# Altium project Modulo Banco MK1.PrjPcb (part 1 of 2)
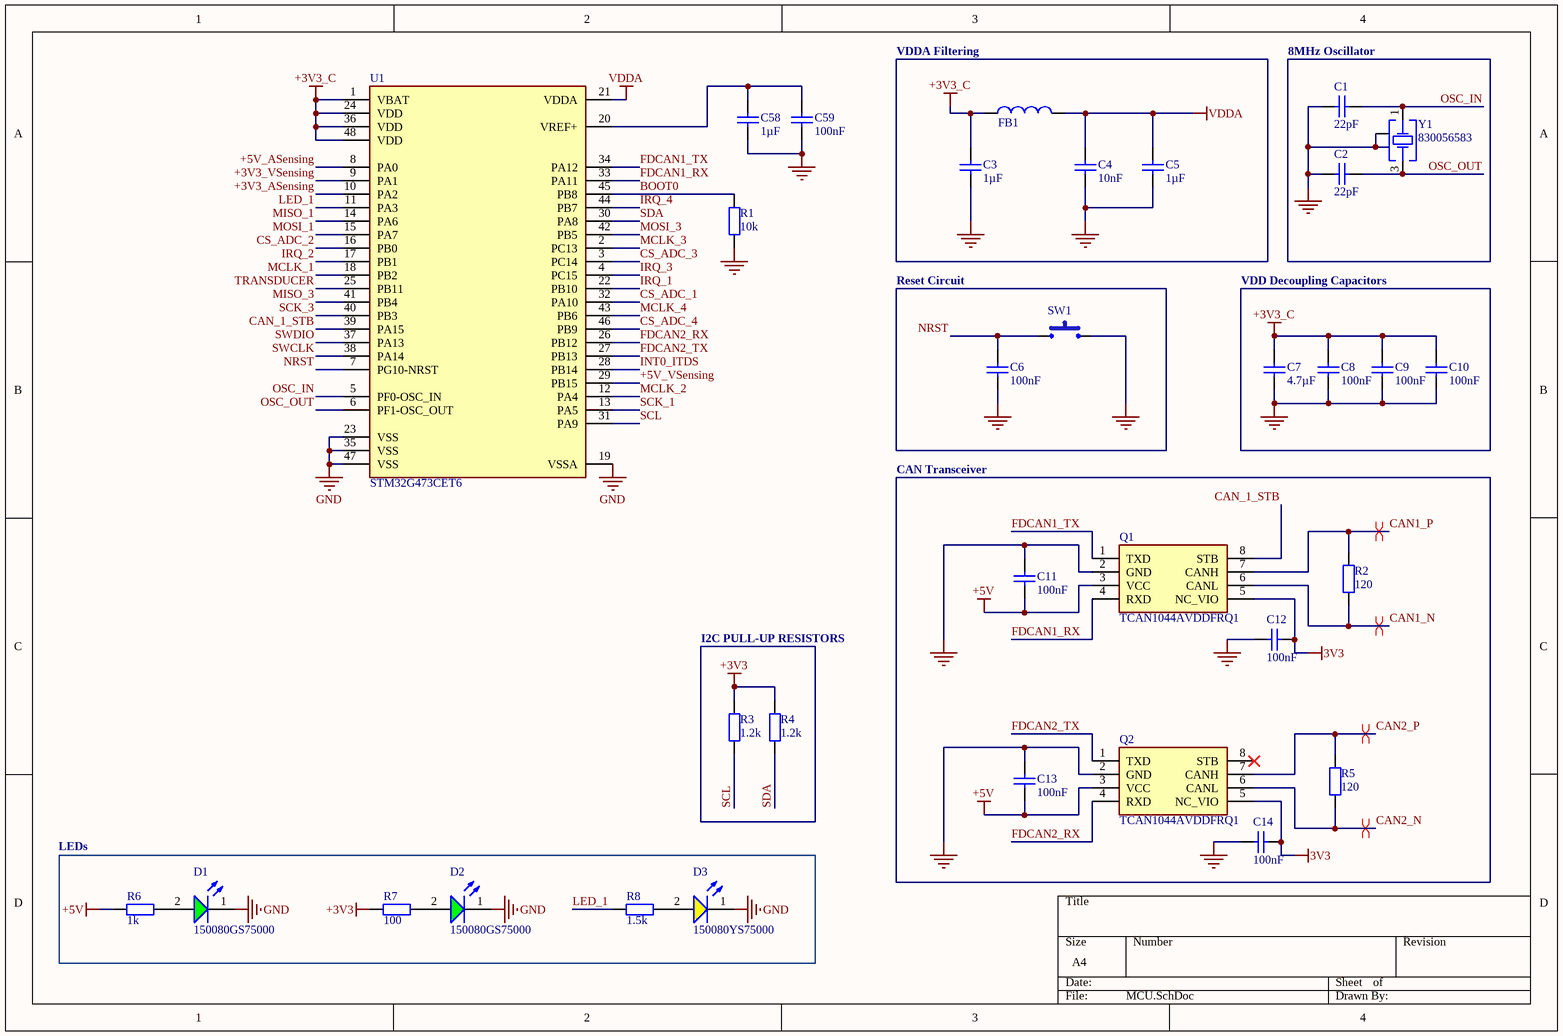
[diagram p0: MCU.SchDoc]
6 sheets, 168 parts. Net scope: global (net labels, ports and power ports of the same name join across sheets).
Board file: PCB_Banco.PcbDoc
Sheets:
  MCU.SchDoc
  Connectors_ADC.SchDoc
  Connectors_General.SchDoc
  Sensors.SchDoc
  ADCs.SchDoc
  Sensing current.SchDoc

## Sheet MCU.SchDoc
size A4; SheetNumber: 1; SheetTotal: 6; SPICEModelCacheQSCFDVKM: <root> / <DocumentId>QSCFDVKM</DocumentId> / <CacheFrame Number="0"> / <Model Name="0805_150080gs75000" Kind="CKT"> / <Text>****** / .subckt 0805_150080GS75000  1  2 / D1 1 2 SMCW / .MODEL SMCW D / + IS=906.98E-12 / + N=4.4982 / + RS=1.5743 / + IKF=518.93E-9 / + CJO=1.0000E-12 / + M=.3333 / + VJ=.75 / + BV=5 / + IBV=10.00E-6 / + TT=5.0000E-9 / .ends</Text> / </Model> / <Model Name="0603_885012206071_100nf" Kind="CKT"> / <Text>******* / .subckt 0603_885012206071_100nF 1 2 / Rser 1 3 0.025 / Lser 2 4 0.0000000008 / C1 3 4 0.0000001 / Rpar 3 4 5000000000 / .ends 0603_885012206071_100nF</Text> / </Model> / <Model Name="0805_150080ys75000" Kind="CKT"> / <Text>****** / .subckt 0805_150080YS75000  1  2 / D1 1 2 SMCW / .MODEL SMCW D / + IS=10.000E-21 / + N=1.8000 / + RS=1.0003E-6 / + IKF=1.8092E-3 / + CJO=1.0000E-12 / + M=.3333 / + VJ=.75 / + BV=5 / + IBV=10.00E-6 / + TT=5.0000E-9 / .ends</Text> / </Model> / </CacheFrame> / </root>

### Parts
C1  value 22pF  [WCAP-CSGP_0603_L1.6W0.8H0.8_Reflow]  (hidden comment: 885012006034)
C2  value 22pF  [WCAP-CSGP_0603_L1.6W0.8H0.8_Reflow]  (hidden comment: 885012006034)
C3  value 1µF  [WCAP-CSGP_0603_L1.6W0.8H0.8_Reflow]  (hidden comment: 885012206052)
C4  value 10nF  [WCAP-CSGP_0603_L1.6W0.8H0.8_Reflow]  (hidden comment: 885012206065)
C5  value 1µF  [WCAP-CSGP_0603_L1.6W0.8H0.8_Reflow]  (hidden comment: 885012206052)
C6  value 100nF  [WCAP-CSGP_0603_L1.6W0.8H0.8_Reflow]  (hidden comment: 885012206071)
C7  value 4.7µF  [WCAP-CSGP_0603_L1.6W0.8H0.8_Reflow]  (hidden comment: 885012106012)
C8  value 100nF  [WCAP-CSGP_0603_L1.6W0.8H0.8_Reflow]  (hidden comment: 885012206071)
C9  value 100nF  [WCAP-CSGP_0603_L1.6W0.8H0.8_Reflow]  (hidden comment: 885012206071)
C10  value 100nF  [WCAP-CSGP_0603_L1.6W0.8H0.8_Reflow]  (hidden comment: 885012206071)
C11  value 100nF  [WCAP-CSGP_0603_L1.6W0.8H0.8_Reflow]  (hidden comment: 885012206071)
C12  value 100nF  [WCAP-CSGP_0603_L1.6W0.8H0.8_Reflow]  (hidden comment: 885012206071)
C13  value 100nF  [WCAP-CSGP_0603_L1.6W0.8H0.8_Reflow]  (hidden comment: 885012206071)
C14  value 100nF  [WCAP-CSGP_0603_L1.6W0.8H0.8_Reflow]  (hidden comment: 885012206071)
C58  value 1µF  [WCAP-CSGP_0603_L1.6W0.8H0.8_Reflow]  (hidden comment: 885012206052)
C59  value 100nF  [WCAP-CSGP_0603_L1.6W0.8H0.8_Reflow]  (hidden comment: 885012206071)
D1  150080GS75000  [WL-SMCW_0805_150080xx75000]
D2  150080GS75000  [WL-SMCW_0805_150080xx75000]
D3  150080YS75000  [WL-SMCW_0805_150080xx75000]
FB1  742792625  [WE-CBF_0603_L1.6W0.8H0.8_HC]  (value not drawn)
Q1  TCAN1044AVDDFRQ1  [FP-DDF0008A-MFG]
Q2  TCAN1044AVDDFRQ1  [FP-DDF0008A-MFG]
R1  value 10k  [WRIS-RSKS_0603_Reflow]  (hidden comment: 560112116005)
R2  value 120  [RCS0805120RFKEA-Footprint-1]  (hidden comment: RCS0805120RFKEA)
R3  value 1.2k  [WRIS-RSKS_0603_Reflow]  (hidden comment: 560112116070)
R4  value 1.2k  [WRIS-RSKS_0603_Reflow]  (hidden comment: 560112116070)
R5  value 120  [RCS0805120RFKEA-Footprint-1]  (hidden comment: RCS0805120RFKEA)
R6  value 1k  [WRIS-RSKS_0603_Reflow]  (hidden comment: 560112116014)
R7  value 100  [WRIS-RSKS_0603_Reflow]  (hidden comment: 560112116009)
R8  value 1.5k  [WRIS-RSKS_0603_Reflow]  (hidden comment: 560112116038)
SW1  PTS815SJM250SMTRLFS  [PTS815SJM250SMTRLFS-Footprint-1]  (value not drawn)
U1  STM32G473CET6  [STM32G0C1RET6-Footprint-1]
Y1  830056583  [WE-XTAL_CFPX-104]

### Blocks framed on the sheet
VDDA Filtering: C3-C5 FB1
8MHz Oscillator: C1 C2 Y1
Reset Circuit: C6 SW1
VDD Decoupling Capacitors: C7-C10
CAN Transceiver: C11-C14 Q1 Q2 R2 R5
I2C PULL-UP RESISTORS: R3 R4
LEDs: D1-D3 R6-R8

### Nets
+3V3: R3.2 R4.2 R7.1  [project net 3V3_Current-]
+3V3_C: C3.2 C7.2 C8.2 C9.2 C10.2 C12.1 C14.1 FB1.1 Q1.5(NC_VIO) Q2.5(NC_VIO) U1.1(VBAT) U1.24(VDD) U1.36(VDD) U1.48(VDD)  [also labelled 3V3]
+5V: C11.1 C13.1 Q1.3(VCC) Q2.3(VCC) R6.1  [project net 5V_Current-]
GND: C1.2 C2.2 C3.1 C4.1 C5.1 C6.1 C7.1 C8.1 C9.1 C10.1 C11.2 C12.2 C13.2 C14.2 C58.1 C59.1 D1.1(K) D2.1(K) D3.1(K) Q1.2(GND) Q2.2(GND) R1.1 SW1.2 U1.19(VSSA) U1.23(VSS) U1.35(VSS) U1.47(VSS) Y1.2(GND_&_Lid) Y1.4(GND_&_Lid)
VDDA: C4.2 C5.2 FB1.2 U1.21(VDDA)
+3V3_ASensing: U1.10(PA2)
+3V3_VSensing: U1.9(PA1)
+5V_ASensing: U1.8(PA0)
+5V_VSensing: U1.29(PB15)
BOOT0: R1.2 U1.45(PB8)
CAN1_N: Q1.6(CANL) R2.1
CAN1_P: Q1.7(CANH) R2.2
CAN2_N: Q2.6(CANL) R5.1
CAN2_P: Q2.7(CANH) R5.2
CAN_1_STB: Q1.8(STB) U1.39(PA15)
CS_ADC_1: U1.32(PA10)
CS_ADC_2: U1.16(PB0)
CS_ADC_3: U1.3(PC14)
CS_ADC_4: U1.46(PB9)
FDCAN1_RX: Q1.4(RXD) U1.33(PA11)
FDCAN1_TX: Q1.1(TXD) U1.34(PA12)
FDCAN2_RX: Q2.4(RXD) U1.26(PB12)
FDCAN2_TX: Q2.1(TXD) U1.27(PB13)
INT0_ITDS: U1.28(PB14)
IRQ_1: U1.22(PB10)
IRQ_2: U1.17(PB1)
IRQ_3: U1.4(PC15)
IRQ_4: U1.44(PB7)
LED_1: R8.1 U1.11(PA3)
MCLK_1: U1.18(PB2)
MCLK_2: U1.12(PA4)
MCLK_3: U1.2(PC13)
MCLK_4: U1.43(PB6)
MISO_1: U1.14(PA6)
MISO_3: U1.41(PB4)
MOSI_1: U1.15(PA7)
MOSI_3: U1.42(PB5)
NRST: C6.2 SW1.1 U1.7(PG10-NRST)
OSC_IN: C1.1 U1.5(PF0-OSC_IN) Y1.1(Crystal)
OSC_OUT: C2.1 U1.6(PF1-OSC_OUT) Y1.3(Crystal)
SCK_1: U1.13(PA5)
SCK_3: U1.40(PB3)
SCL: R3.1 U1.31(PA9)
SDA: R4.1 U1.30(PA8)
SWCLK: U1.38(PA14)
SWDIO: U1.37(PA13)
TRANSDUCER: U1.25(PB11)
NetC58_2: C58.2 C59.2 U1.20(VREF+)
NetD1_2: D1.2(A) R6.2
NetD2_2: D2.2(A) R7.2
NetD3_2: D3.2(A) R8.2

Not connected (* = marked no-connect by the designer): Q2 8(STB)*

### Layout directives
differential pair: CAN1_N, CAN1_P, CAN2_N, CAN2_P

### Library data of the parts
C1 C2 = CMP-001-00150-1: WCAP-CSGP Multilayer Ceramic Chip Capacitor, General Purpose, size 0603, NP0, 22pF, 25VDC; Manufacturer: Wurth Elektronik; Q Factor: 840; Capacitance Tolerance: +/-5%; Insulation Resistance: 10GOhm; Technical Reference: NP00603220J025DFCT10000; Rated Voltage (DC): 25V; Category: Multilayer Ceramic Chip Capacitors; ComponentLink2URL: https://www.we-online.com/redexpert/spec/885012006034?ad; ComponentLink1Description: Website Link; Operating Temperature Max: 125°C; Ceramic Type: NP0; Operating Temperature Min: -55°C; Case/Package: 0603; Component Type: Standard; Width: 0.8mm; Source: WCAP-CSGP.SchLib; Pins: 2; Packaging: Tape and Reel; Mount: Surface Mount; ComponentLink2Description: Datasheet Link; ComponentLink1URL: https://www.we-online.com/redexpert/article/885012006034?ad; Manufacturer Part Number: 885012006034; Match Code: WCAP-CSGP; Design Item ID: 885012006034; Length: 1.6mm; Height: 0.8mm
C3 C5 C58 = CMP-001-00642-1: WCAP-CSGP Multilayer Ceramic Chip Capacitor, General Purpose, size 0603, X7R, 1uF, 16VDC; Manufacturer: Wurth Elektronik; Capacitance Tolerance: +/-10%; Insulation Resistance: 0.1GOhm; Rated Voltage (DC): 16V; Dissipation Factor: 10%; Technical Reference: X7R0603105K016DFCT10000; Component Type: Standard; Width: 0.8mm; Ceramic Type: X7R; ComponentLink1Description: Website Link; ComponentLink1URL: https://www.we-online.com/redexpert/article/885012206052?ad; Height: 0.8mm; Manufacturer Part Number: 885012206052; Match Code: WCAP-CSGP; Source: WCAP-CSGP.SchLib; Case/Package: 0603; Operating Temperature Min: -55°C; ComponentLink2Description: Datasheet Link; Design Item ID: 885012206052; ComponentLink2URL: https://www.we-online.com/redexpert/spec/885012206052?ad; Category: Multilayer Ceramic Chip Capacitors; Packaging: Tape and Reel; Pins: 2; Length: 1.6mm; Operating Temperature Max: 125°C; Mount: Surface Mount
C4 = CMP-001-00655-1: WCAP-CSGP Multilayer Ceramic Chip Capacitor, General Purpose, size 0603, X7R, 10nF, 25VDC; Manufacturer: Wurth Elektronik; Dissipation Factor: 3.5%; Technical Reference: X7R0603103K025DFCT10000; Capacitance Tolerance: +/-10%; Insulation Resistance: 10GOhm; Rated Voltage (DC): 25V; ComponentLink1Description: Website Link; Packaging: Tape and Reel; Match Code: WCAP-CSGP; Ceramic Type: X7R; ComponentLink1URL: https://www.we-online.com/redexpert/article/885012206065?ad; ComponentLink2URL: https://www.we-online.com/redexpert/spec/885012206065?ad; Component Type: Standard; Case/Package: 0603; Operating Temperature Min: -55°C; ComponentLink2Description: Datasheet Link; Category: Multilayer Ceramic Chip Capacitors; Pins: 2; Mount: Surface Mount; Height: 0.8mm; Source: WCAP-CSGP.SchLib; Length: 1.6mm; Design Item ID: 885012206065; Operating Temperature Max: 125°C; Width: 0.8mm; Manufacturer Part Number: 885012206065
C6 C8-C14 C59 = CMP-001-00661-1: WCAP-CSGP Multilayer Ceramic Chip Capacitor, General Purpose, size 0603, X7R, 100nF, 25VDC; Manufacturer: Wurth Elektronik; Dissipation Factor: 3.5%; Capacitance Tolerance: +/-10%; Insulation Resistance: 5GOhm; Technical Reference: X7R0603104K025DFCT10000; Rated Voltage (DC): 25V; Packaging: Tape and Reel; Height: 0.8mm; Mount: Surface Mount; Source: WCAP-CSGP.SchLib; Component Type: Standard; Category: Multilayer Ceramic Chip Capacitors; Operating Temperature Min: -55°C; Case/Package: 0603; ComponentLink2Description: Datasheet Link; Width: 0.8mm; ComponentLink1URL: https://www.we-online.com/redexpert/article/885012206071?ad; Length: 1.6mm; Operating Temperature Max: 125°C; Match Code: WCAP-CSGP; ComponentLink2URL: https://www.we-online.com/redexpert/spec/885012206071?ad; Design Item ID: 885012206071; ComponentLink1Description: Website Link; Manufacturer Part Number: 885012206071; Pins: 2; Ceramic Type: X7R
C7 = CMP-001-00440-1: WCAP-CSGP Multilayer Ceramic Chip Capacitor, General Purpose, size 0603, X5R, 4.7uF, 10VDC; Manufacturer: Wurth Elektronik; Rated Voltage (DC): 10V; Technical Reference: X5R0603475M010DFCT10000; Dissipation Factor: 10%; Insulation Resistance: 0.02GOhm; Capacitance Tolerance: +/-20%; ComponentLink2URL: https://www.we-online.com/redexpert/spec/885012106012?ad; Height: 0.8mm; Packaging: Tape and Reel; Case/Package: 0603; Manufacturer Part Number: 885012106012; Component Type: Standard; Width: 0.8mm; Match Code: WCAP-CSGP; Mount: Surface Mount; Ceramic Type: X5R; Operating Temperature Max: 85°C; ComponentLink1Description: Website Link; Length: 1.6mm; ComponentLink1URL: https://www.we-online.com/redexpert/article/885012106012?ad; ComponentLink2Description: Datasheet Link; Category: Multilayer Ceramic Chip Capacitors; Source: WCAP-CSGP.SchLib; Operating Temperature Min: -55°C; Pins: 2; Design Item ID: 885012106012
D1 D2 = CMP-004-00452-1: WL-SMCW Mono-color Chip LED Waterclear, SMT, size 0805, Green, 3.2V, 140°; Manufacturer: Wurth Elektronik; Dominant Wavelength: 525nm; Chip Technology: InGaN; Luminous Intensity: 450mcd; Peak Wavelength: 515nm; Viewing Angle: 140°; Source: WL-SMCW.SchLib; Category: Signal LEDs; Design Item ID: 150080GS75000; ComponentLink1URL: https://www.we-online.com/redexpert/article/150080GS75000?ad; Pins: 2; Emitting Color: Green; Mount: Surface Mount; ComponentLink2URL: https://www.we-online.com/redexpert/spec/150080GS75000?ad; Match Code: WL-SMCW; ComponentLink1Description: Website Link; Operating Temperature Max: 85°C; Case/Package: 0805; Manufacturer Part Number: 150080GS75000; Forward Voltage: 3.2V; Operating Temperature Min: -40°C; Component Type: Standard; Height: 0.7mm; Length: 2mm; Width: 1.25mm; Packaging: Tape and Reel; ComponentLink2Description: Datasheet Link
D3 = CMP-004-00456-1: WL-SMCW Mono-color Chip LED Waterclear, SMT, size 0805, Yellow, 2V, 140°; Manufacturer: Wurth Elektronik; Chip Technology: AlInGaP; Peak Wavelength: 595nm; Luminous Intensity: 120mcd; Dominant Wavelength: 590nm; ComponentLink1URL: https://www.we-online.com/redexpert/article/150080YS75000?ad; Match Code: WL-SMCW; Design Item ID: 150080YS75000; ComponentLink2Description: Datasheet Link; Mount: Surface Mount; Emitting Color: Yellow; Pins: 2; Case/Package: 0805; Viewing Angle: 140°; Packaging: Tape and Reel; Width: 1.25mm; ComponentLink2URL: https://www.we-online.com/redexpert/spec/150080YS75000?ad; Length: 2mm; Forward Voltage: 2V; Source: WL-SMCW.SchLib; Operating Temperature Max: 85°C; Manufacturer Part Number: 150080YS75000; Component Type: Standard; Operating Temperature Min: -40°C; ComponentLink1Description: Website Link; Category: Signal LEDs; Height: 0.7mm
FB1 = CMP-006-00120-1: WE-CBF SMT EMI Suppression Ferrite Bead, size 0603, 120Ohm, 2A; Manufacturer: Wurth Elektronik; Impedance Max: 180Ohm; Type: High Current; Impedance Max Test Condition: 400MHz; DC Resistance Max: 0.05Ohm; Length: 1.6mm; Mount: Surface Mount; Source: WE-CBF.SchLib; ComponentLink2Description: Datasheet Link; Match Code: WE-CBF; Height: 0.8mm; Pins: 2; Manufacturer Part Number: 742792625; ComponentLink1Description: Website Link; Component Type: Standard; Packaging: Tape and Reel; Design Item ID: 742792625; Operating Temperature Max: 125°C; Operating Temperature Min: -55°C; Rated Current: 2A; ComponentLink1URL: https://www.we-online.com/redexpert/article/742792625?ad; Category: Ferrites for PCB Assembly; ComponentLink2URL: https://www.we-online.com/redexpert/spec/742792625?ad; Case/Package: 0603; Width: 0.8mm; Impedance @100MHz: 120Ohm
Q1 Q2 = CMP-015-00003-4: Enhanced automotive CAN transceiver with standby 8-SOT-23-THIN -40 to 150
R1 = CMP-009-00328-1: WRIS-RSKS Thick Film Resistor, size 0603, 10000Ohm, 100mW; Manufacturer: Wurth Elektronik; Limiting Element Voltage: 75V; Temperature Coefficient of Resistance Max: 100ppm/°C; Resistance Tolerance: +/-1%; Temperature Coefficient of Resistance Min: -100ppm/°C; ComponentLink1Description: Website Link; Case/Package: 0603; Pins: 2; Match Code: WRIS-RSKS; Operating Temperature Max: 155°C; Width: 0.8mm; Design Item ID: 560112116005; Length: 1.6mm; ComponentLink2Description: Datasheet Link; ComponentLink2URL: https://www.we-online.com/redexpert/spec/560112116005?ad; Packaging: Tape and Reel; Source: WRIS-RSKS.SchLib; Height: 0.45mm; Manufacturer Part Number: 560112116005; Component Type: Standard; Mount: Surface Mount; Operating Temperature Min: -55°C; Rated Power: 100mW; ComponentLink1URL: https://www.we-online.com/redexpert/article/560112116005?ad; Category: Thick Film Resistors
R2 R5 = CMP-009-00119-3: Fixed Resistor, Metal Glaze/thick Film, 0.4W, 120ohm, 150V, 1% +/-Tol, 100ppm/Cel, Surface Mount, 0805; Power: 500mW; Case/Package: 0805; Mounting Technology: SMD; Pins: 2
R3 R4 = CMP-009-00393-1: WRIS-RSKS Thick Film Resistor, size 0603, 1200Ohm, 100mW; Manufacturer: Wurth Elektronik; Limiting Element Voltage: 75V; Temperature Coefficient of Resistance Max: 100ppm/°C; Resistance Tolerance: +/-1%; Temperature Coefficient of Resistance Min: -100ppm/°C; Mount: Surface Mount; Pins: 2; Manufacturer Part Number: 560112116070; Case/Package: 0603; Category: Thick Film Resistors; Source: WRIS-RSKS.SchLib; ComponentLink1URL: https://www.we-online.com/redexpert/article/560112116070?ad; Length: 1.6mm; ComponentLink1Description: Website Link; ComponentLink2Description: Datasheet Link; ComponentLink2URL: https://www.we-online.com/redexpert/spec/560112116070?ad; Component Type: Standard; Width: 0.8mm; Packaging: Tape and Reel; Match Code: WRIS-RSKS; Design Item ID: 560112116070; Height: 0.45mm; Operating Temperature Min: -55°C; Operating Temperature Max: 155°C; Rated Power: 100mW
R6 = CMP-009-00337-1: WRIS-RSKS Thick Film Resistor, size 0603, 1000Ohm, 100mW; Manufacturer: Wurth Elektronik; Resistance Tolerance: +/-1%; Limiting Element Voltage: 75V; Temperature Coefficient of Resistance Min: -100ppm/°C; Temperature Coefficient of Resistance Max: 100ppm/°C; Mount: Surface Mount; Rated Power: 100mW; Packaging: Tape and Reel; Case/Package: 0603; ComponentLink1URL: https://www.we-online.com/redexpert/article/560112116014?ad; Height: 0.45mm; Manufacturer Part Number: 560112116014; ComponentLink1Description: Website Link; ComponentLink2URL: https://www.we-online.com/redexpert/spec/560112116014?ad; Source: WRIS-RSKS.SchLib; Operating Temperature Min: -55°C; Width: 0.8mm; Match Code: WRIS-RSKS; Design Item ID: 560112116014; ComponentLink2Description: Datasheet Link; Category: Thick Film Resistors; Operating Temperature Max: 155°C; Component Type: Standard; Length: 1.6mm; Pins: 2
R7 = CMP-009-00332-1: WRIS-RSKS Thick Film Resistor, size 0603, 100Ohm, 100mW; Manufacturer: Wurth Elektronik; Limiting Element Voltage: 75V; Resistance Tolerance: +/-1%; Temperature Coefficient of Resistance Max: 100ppm/°C; Temperature Coefficient of Resistance Min: -100ppm/°C; Mount: Surface Mount; Design Item ID: 560112116009; Height: 0.45mm; Category: Thick Film Resistors; Operating Temperature Min: -55°C; Width: 0.8mm; Manufacturer Part Number: 560112116009; ComponentLink2Description: Datasheet Link; Pins: 2; ComponentLink2URL: https://www.we-online.com/redexpert/spec/560112116009?ad; Component Type: Standard; Case/Package: 0603; ComponentLink1URL: https://www.we-online.com/redexpert/article/560112116009?ad; Rated Power: 100mW; ComponentLink1Description: Website Link; Operating Temperature Max: 155°C; Source: WRIS-RSKS.SchLib; Packaging: Tape and Reel; Length: 1.6mm; Match Code: WRIS-RSKS
R8 = CMP-009-00361-1: WRIS-RSKS Thick Film Resistor, size 0603, 1500Ohm, 100mW; Manufacturer: Wurth Elektronik; Temperature Coefficient of Resistance Max: 100ppm/°C; Temperature Coefficient of Resistance Min: -100ppm/°C; Limiting Element Voltage: 75V; Resistance Tolerance: +/-1%; Component Type: Standard; Pins: 2; Packaging: Tape and Reel; Design Item ID: 560112116038; Case/Package: 0603; Operating Temperature Max: 155°C; Length: 1.6mm; ComponentLink2URL: https://www.we-online.com/redexpert/spec/560112116038?ad; ComponentLink1Description: Website Link; Operating Temperature Min: -55°C; Source: WRIS-RSKS.SchLib; Height: 0.45mm; Rated Power: 100mW; Match Code: WRIS-RSKS; Mount: Surface Mount; Category: Thick Film Resistors; Manufacturer Part Number: 560112116038; ComponentLink1URL: https://www.we-online.com/redexpert/article/560112116038?ad; Width: 0.8mm; ComponentLink2Description: Datasheet Link
SW1 = CMP-011-00002-1: Keypad Switch, 1 Switches, SPST, Momentary-tactile, 0.05A, 12VDC, 2.26N, Solder Terminal, Surface Mount-straight
U1 = CMP-020-00001-7: Microcontroladores ARM (MCU) Mainstream Arm Cortex-M4+ MCU 170MHz 512Kbytes Math Accelerator High Analog
Y1 = CMP-003-00170-1: WE-XTAL Quartz Crystal, SMT, CFPX-104, 10MHz, +/-30ppm; Manufacturer: Wurth Elektronik; Load Capacitance: 12pF; Component Type: Standard; Operating Temperature Min: -40°C; Pins: 4; ComponentLink2URL: https://www.we-online.com/redexpert/spec/830056583?ad; Frequency Tolerance: +/-30ppm; Packaging: Tape and Reel; Match Code: WE-XTAL; Frequency Stability: +/-30ppm; ComponentLink1URL: https://www.we-online.com/redexpert/article/830056583?ad; Mount: Surface Mount; ComponentLink1Description: Website Link; Source: WE-XTAL.SchLib; Length: 5mm; Manufacturer Part Number: 830056583; Width: 3.2mm; Design Item ID: 830056583; Height: 1mm; Frequency: 10MHz; Operating Temperature Max: 85°C; Case/Package: CFPX-104; ComponentLink2Description: Datasheet Link; Category: Crystals

## Sheet Connectors_ADC.SchDoc
size A4; SheetNumber: 2; SheetTotal: 6; SPICEModelCacheCWWNLBKH: <root> / <DocumentId>CWWNLBKH</DocumentId> / <CacheFrame Number="0"> / <Model Name="0603_885012206071_100nf" Kind="CKT"> / <Text>******* / .subckt 0603_885012206071_100nF 1 2 / Rser 1 3 0.025 / Lser 2 4 0.0000000008 / C1 3 4 0.0000001 / Rpar 3 4 5000000000 / .ends 0603_885012206071_100nF</Text> / </Model> / </CacheFrame> / </root>
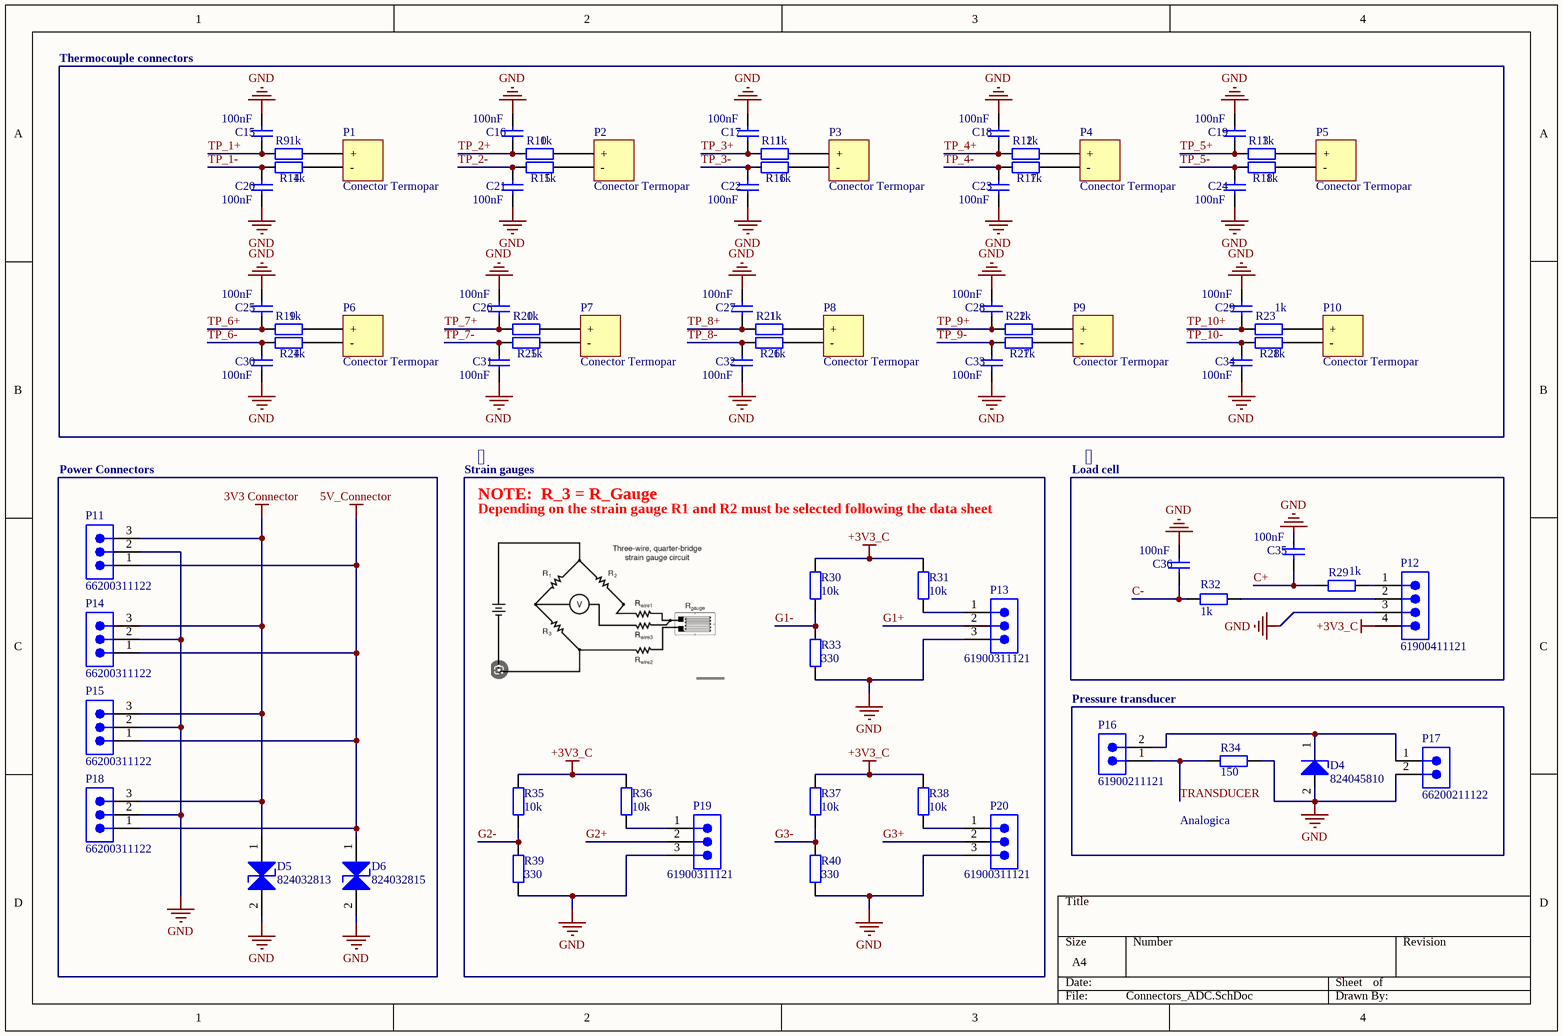
[diagram p1: Connectors_ADC.SchDoc]

### Parts
C15  value 100nF  [WCAP-CSGP_0603_L1.6W0.8H0.8_Reflow]  (hidden comment: 885012206071)
C16  value 100nF  [WCAP-CSGP_0603_L1.6W0.8H0.8_Reflow]  (hidden comment: 885012206071)
C17  value 100nF  [WCAP-CSGP_0603_L1.6W0.8H0.8_Reflow]  (hidden comment: 885012206071)
C18  value 100nF  [WCAP-CSGP_0603_L1.6W0.8H0.8_Reflow]  (hidden comment: 885012206071)
C19  value 100nF  [WCAP-CSGP_0603_L1.6W0.8H0.8_Reflow]  (hidden comment: 885012206071)
C20  value 100nF  [WCAP-CSGP_0603_L1.6W0.8H0.8_Reflow]  (hidden comment: 885012206071)
C21  value 100nF  [WCAP-CSGP_0603_L1.6W0.8H0.8_Reflow]  (hidden comment: 885012206071)
C22  value 100nF  [WCAP-CSGP_0603_L1.6W0.8H0.8_Reflow]  (hidden comment: 885012206071)
C23  value 100nF  [WCAP-CSGP_0603_L1.6W0.8H0.8_Reflow]  (hidden comment: 885012206071)
C24  value 100nF  [WCAP-CSGP_0603_L1.6W0.8H0.8_Reflow]  (hidden comment: 885012206071)
C25  value 100nF  [WCAP-CSGP_0603_L1.6W0.8H0.8_Reflow]  (hidden comment: 885012206071)
C26  value 100nF  [WCAP-CSGP_0603_L1.6W0.8H0.8_Reflow]  (hidden comment: 885012206071)
C27  value 100nF  [WCAP-CSGP_0603_L1.6W0.8H0.8_Reflow]  (hidden comment: 885012206071)
C28  value 100nF  [WCAP-CSGP_0603_L1.6W0.8H0.8_Reflow]  (hidden comment: 885012206071)
C29  value 100nF  [WCAP-CSGP_0603_L1.6W0.8H0.8_Reflow]  (hidden comment: 885012206071)
C30  value 100nF  [WCAP-CSGP_0603_L1.6W0.8H0.8_Reflow]  (hidden comment: 885012206071)
C31  value 100nF  [WCAP-CSGP_0603_L1.6W0.8H0.8_Reflow]  (hidden comment: 885012206071)
C32  value 100nF  [WCAP-CSGP_0603_L1.6W0.8H0.8_Reflow]  (hidden comment: 885012206071)
C33  value 100nF  [WCAP-CSGP_0603_L1.6W0.8H0.8_Reflow]  (hidden comment: 885012206071)
C34  value 100nF  [WCAP-CSGP_0603_L1.6W0.8H0.8_Reflow]  (hidden comment: 885012206071)
C35  value 100nF  [WCAP-CSGP_0603_L1.6W0.8H0.8_Reflow]  (hidden comment: 885012206071)
C36  value 100nF  [WCAP-CSGP_0603_L1.6W0.8H0.8_Reflow]  (hidden comment: 885012206071)
D4  824045810  [WE-TVS_DFN1610-2L]
D5  824032813  [WE-TVS_DFN1610-2L]
D6  824032815  [WE-TVS_DFN1610-2L]
P1  Conector Termopar  [New footprint 1]
P2  Conector Termopar  [New footprint 1]
P3  Conector Termopar  [New footprint 1]
P4  Conector Termopar  [New footprint 1]
P5  Conector Termopar  [New footprint 1]
P6  Conector Termopar  [New footprint 1]
P7  Conector Termopar  [New footprint 1]
P8  Conector Termopar  [New footprint 1]
P9  Conector Termopar  [New footprint 1]
P10  Conector Termopar  [New footprint 1]
P11  66200311122  [66200311122]
P12  61900411121  [61900411121]
P13  61900311121  [61900311121]
P14  66200311122  [66200311122]
P15  66200311122  [66200311122]
P16  61900211121  [61900211121]
P17  66200211122  [66200211122]
P18  66200311122  [66200311122]
P19  61900311121  [61900311121]
P20  61900311121  [61900311121]
R9  value 1k  [WRIS-RSKS_0603_Reflow]  (hidden comment: 560112116014)
R10  value 1k  [WRIS-RSKS_0603_Reflow]  (hidden comment: 560112116014)
R11  value 1k  [WRIS-RSKS_0603_Reflow]  (hidden comment: 560112116014)
R12  value 1k  [WRIS-RSKS_0603_Reflow]  (hidden comment: 560112116014)
R13  value 1k  [WRIS-RSKS_0603_Reflow]  (hidden comment: 560112116014)
R14  value 1k  [WRIS-RSKS_0603_Reflow]  (hidden comment: 560112116014)
R15  value 1k  [WRIS-RSKS_0603_Reflow]  (hidden comment: 560112116014)
R16  value 1k  [WRIS-RSKS_0603_Reflow]  (hidden comment: 560112116014)
R17  value 1k  [WRIS-RSKS_0603_Reflow]  (hidden comment: 560112116014)
R18  value 1k  [WRIS-RSKS_0603_Reflow]  (hidden comment: 560112116014)
R19  value 1k  [WRIS-RSKS_0603_Reflow]  (hidden comment: 560112116014)
R20  value 1k  [WRIS-RSKS_0603_Reflow]  (hidden comment: 560112116014)
R21  value 1k  [WRIS-RSKS_0603_Reflow]  (hidden comment: 560112116014)
R22  value 1k  [WRIS-RSKS_0603_Reflow]  (hidden comment: 560112116014)
R23  value 1k  [WRIS-RSKS_0603_Reflow]  (hidden comment: 560112116014)
R24  value 1k  [WRIS-RSKS_0603_Reflow]  (hidden comment: 560112116014)
R25  value 1k  [WRIS-RSKS_0603_Reflow]  (hidden comment: 560112116014)
R26  value 1k  [WRIS-RSKS_0603_Reflow]  (hidden comment: 560112116014)
R27  value 1k  [WRIS-RSKS_0603_Reflow]  (hidden comment: 560112116014)
R28  value 1k  [WRIS-RSKS_0603_Reflow]  (hidden comment: 560112116014)
R29  value 1k  [WRIS-RSKS_0603_Reflow]  (hidden comment: 560112116014)
R30  value 10k  [WRIS-RSKS_0603_Reflow]  (hidden comment: 560112116005)
R31  value 10k  [WRIS-RSKS_0603_Reflow]  (hidden comment: 560112116005)
R32  value 1k  [WRIS-RSKS_0603_Reflow]  (hidden comment: 560112116014)
R33  value 330  [WRIS-RSKS_0603_Reflow]  (hidden comment: 560112116020)
R34  value 150  [WRIS-RSKS_0603_Reflow]  (hidden comment: 560112116041)
R35  value 10k  [WRIS-RSKS_0603_Reflow]  (hidden comment: 560112116005)
R36  value 10k  [WRIS-RSKS_0603_Reflow]  (hidden comment: 560112116005)
R37  value 10k  [WRIS-RSKS_0603_Reflow]  (hidden comment: 560112116005)
R38  value 10k  [WRIS-RSKS_0603_Reflow]  (hidden comment: 560112116005)
R39  value 330  [WRIS-RSKS_0603_Reflow]  (hidden comment: 560112116020)
R40  value 330  [WRIS-RSKS_0603_Reflow]  (hidden comment: 560112116020)

### Blocks framed on the sheet
Thermocouple connectors: C15-C34 P1-P10 R9-R28
Power Connectors: D5 D6 P11 P14 P15 P18
: P13 P19 P20 R30 R31 R33 R35-R40
: C35 C36 P12 R29 R32

### Nets
3V3 Connector: D5.1(I/O_1) P11.3 P14.3 P15.3 P18.3  [project net 3V3_Current+]
5V_Connector: D6.1(I/O_1) P11.1 P14.1 P15.1 P18.1  [project net 5V_Current+]
+3V3_C: P12.4 R30.2 R31.2 R35.2 R36.2 R37.2 R38.2
GND: C15.2 C16.2 C17.2 C18.2 C19.2 C20.1 C21.1 C22.1 C23.1 C24.1 C25.2 C26.2 C27.2 C28.2 C29.2 C30.1 C31.1 C32.1 C33.1 C34.1 C35.2 C36.2 D4.2(GND) D5.2(GND) D6.2(GND) P11.2 P12.3 P13.3 P14.2 P15.2 P17.2 P18.2 P19.3 P20.3 R33.1 R34.1 R39.1 R40.1
C+: C35.1 R29.1
C-: C36.1 R32.1
G1+: P13.2
G1-: R30.1 R33.2
G2+: P19.2
G2-: R35.1 R39.2
G3+: P20.2
G3-: R37.1 R40.2
TP_1+: C15.1 R9.1
TP_1-: C20.2 R14.1
TP_2+: C16.1 R10.1
TP_2-: C21.2 R15.1
TP_3+: C17.1 R11.1
TP_3-: C22.2 R16.1
TP_4+: C18.1 R12.1
TP_4-: C23.2 R17.1
TP_5+: C19.1 R13.1
TP_5-: C24.2 R18.1
TP_6+: C25.1 R19.1
TP_6-: C30.2 R24.1
TP_7+: C26.1 R20.1
TP_7-: C31.2 R25.1
TP_8+: C27.1 R21.1
TP_8-: C32.2 R26.1
TP_9+: C28.1 R22.1
TP_9-: C33.2 R27.1
TP_10+: C29.1 R23.1
TP_10-: C34.2 R28.1
TRANSDUCER: P16.1 R34.2
NetD4_1: D4.1(I/O_1) P16.2 P17.1
NetP1_1: P1.1(+) R9.2
NetP1_2: P1.2(-) R14.2
NetP2_1: P2.1(+) R10.2
NetP2_2: P2.2(-) R15.2
NetP3_1: P3.1(+) R11.2
NetP3_2: P3.2(-) R16.2
NetP4_1: P4.1(+) R12.2
NetP4_2: P4.2(-) R17.2
NetP5_1: P5.1(+) R13.2
NetP5_2: P5.2(-) R18.2
NetP6_1: P6.1(+) R19.2
NetP6_2: P6.2(-) R24.2
NetP7_1: P7.1(+) R20.2
NetP7_2: P7.2(-) R25.2
NetP8_1: P8.1(+) R21.2
NetP8_2: P8.2(-) R26.2
NetP9_1: P9.1(+) R22.2
NetP9_2: P9.2(-) R27.2
NetP10_1: P10.1(+) R23.2
NetP10_2: P10.2(-) R28.2
NetP12_1: P12.1 R29.2
NetP12_2: P12.2 R32.2
NetP13_1: P13.1 R31.1
NetP19_1: P19.1 R36.1
NetP20_1: P20.1 R38.1

### Notes on the sheet
- Strain gauges
- NOTE:  R_3 = R_Gauge
- Depending on the strain gauge R1 and R2 must be selected following the data sheet
- Load cell
- Pressure transducer
- Analogica

### Library data of the parts
C15-C36 = CMP-001-00661-1: as C6 on sheet MCU; Packaging: Tape and Reel; Height: 0.8mm; Mount: Surface Mount; Source: WCAP-CSGP.SchLib; Component Type: Standard; Category: Multilayer Ceramic Chip Capacitors; Operating Temperature Min: -55°C; Case/Package: 0603; ComponentLink2Description: Datasheet Link; Width: 0.8mm; ComponentLink1URL: https://www.we-online.com/redexpert/article/885012206071?ad; Length: 1.6mm; Operating Temperature Max: 125°C; Match Code: WCAP-CSGP; ComponentLink2URL: https://www.we-online.com/redexpert/spec/885012206071?ad; Design Item ID: 885012206071; ComponentLink1Description: Website Link; Manufacturer Part Number: 885012206071; Pins: 2; Ceramic Type: X7R
D4 = CMP-004-00054-1: WE-TVS TVS Diode – Standard Series, DFN1610-2L, 1 Channel, 20V, 240pF; Manufacturer: Wurth Elektronik; Channel ESD Clamping Voltage: 25.5V; Channel Reverse Leakage Current: 1uA; ESD Air Discharge Capability: 30kV; (Reverse) Breakdown Voltage: 22.8V; Polarity: Unidirectional; (Reverse) Peak Pulse Current: 24A; Number of Channels: 1; Length: 1.6mm; Operating Temperature Max: 85°C; Case/Package: DFN1610-2L; Design Item ID: 824045810; ComponentLink2URL: https://www.we-online.com/redexpert/spec/824045810?ad; ComponentLink1URL: https://www.we-online.com/redexpert/article/824045810?ad; Height: 0.5mm; Channel Input Capacitance: 240pF; Component Type: Standard; Match Code: WE-TVS; Operating Temperature Min: -55°C; ComponentLink2Description: Datasheet Link; Source: WE-TVS.SchLib; Manufacturer Part Number: 824045810; Channel Operating Voltage: 20V; Pins: 2; Mount: Surface Mount; Packaging: Tape and Reel; Category: ESD Protection; ComponentLink1Description: Website Link; ESD Contact Discharge Capability: 30kV; Width: 1mm
D5 = CMP-03913-133963840-1: 824032813 Tvs Diode, Bidir, 3.3V, Dfn1610 Rohs Compliant: Yes; Width: 1mm; NexarPartId: 133963840; Min Operating Temperature: -55°C; Max Operating Temperature: 125°C; Height: 500µm; Length: 1.6mm; RoHS: Compliant
D6 = CMP-03913-133963841-1: 824032815 Tvs Diode, Bidir, 5V, Dfn1610 Rohs Compliant: Yes; Min Operating Temperature: -55°C; Width: 1mm; NexarPartId: 133963841; Length: 1.6mm; RoHS: Compliant; Max Operating Temperature: 85°C; Height: 500µm
P1-P10 = CMP-002-00006-3: Conector para termopar vertical (hembra)
P11 P14 P15 P18 = CMP-002-00024-2: WR-MPC3 THT Male Vertical Header, pitch 3mm, 3p; Manufacturer: Wurth Elektronik; Working Voltage: 250V (AC); Rated Current: 5A; Insulation Resistance: >1000MOhm; Contact Resistance: 10mOhm; Manufacturer Part Number: 66200311122; Operating Temperature Max: 105°C; Mount: Through Hole; ComponentLink1Description: Website Link; Operating Temperature Min: -40°C; Design Item ID: 66200311122; ComponentLink2Description: Datasheet Link; Number of Rows: 1; Pitch: 3mm; ComponentLink2URL: https://www.we-online.com/redexpert/spec/66200311122?ad; Gender: Male; Length: 12.65mm; Orientation: Vertical; Component Type: Standard; Pin Count: 3; Packaging: Tube; Width: 5.57mm; ComponentLink1URL: https://www.we-online.com/redexpert/article/66200311122?ad; Height: 11mm; Pins: 3; Source: WR-MPC3.SchLib; Category: Wire-to-Board Connectors; Match Code: WR-MPC3
P12 = CMP-002-00293-1: WR-WTB THT Male Vertical Locking Header, pitch 2.54mm, 4pins; Manufacturer: Wurth Elektronik; Working Voltage: 250VAC; Withstanding Voltage: 1000VAC; Contact Resistance: 20mOhm; Rated Current: 3A; Manufacturer Part Number: 61900411121; Design Item ID: 61900411121; ComponentLink2Description: Datasheet Link; Width: 5.8mm; Operating Temperature Min: -40°C; Number of Rows: 1; Pins: 4; Pitch: 2.54mm; Height: 11.5mm; Gender: Male; Component Type: Standard; ComponentLink2URL: https://www.we-online.com/redexpert/spec/61900411121?ad; Mount: Through Hole; Length: 10.16mm; ComponentLink1URL: https://www.we-online.com/redexpert/article/61900411121?ad; Packaging: Bag; Operating Temperature Max: 105°C; Pin Count: 4; Category: Wire-to-Board Connectors; Source: WR-WTB.SchLib; Orientation: Vertical; Match Code: WR-WTB; ComponentLink1Description: Website Link
P13 P19 P20 = CMP-002-00290-1: WR-WTB THT Male Vertical Locking Header, pitch 2.54mm, 3pins; Manufacturer: Wurth Elektronik; Rated Current: 3A; Working Voltage: 250VAC; Contact Resistance: 20mOhm; Withstanding Voltage: 1000VAC; Match Code: WR-WTB; Component Type: Standard; Operating Temperature Max: 105°C; ComponentLink2Description: Datasheet Link; Gender: Male; Width: 5.8mm; Pitch: 2.54mm; Mount: Through Hole; Manufacturer Part Number: 61900311121; Operating Temperature Min: -40°C; ComponentLink1Description: Website Link; Source: WR-WTB.SchLib; Height: 11.5mm; Pins: 3; Design Item ID: 61900311121; ComponentLink1URL: https://www.we-online.com/redexpert/article/61900311121?ad; Length: 7.62mm; Pin Count: 3; Number of Rows: 1; Orientation: Vertical; Category: Wire-to-Board Connectors; ComponentLink2URL: https://www.we-online.com/redexpert/spec/61900311121?ad; Packaging: Bag
P16 = CMP-002-00287-1: WR-WTB THT Male Vertical Locking Header, pitch 2.54mm, 2pins; Manufacturer: Wurth Elektronik; Withstanding Voltage: 1000VAC; Rated Current: 3A; Working Voltage: 250VAC; Contact Resistance: 20mOhm; Match Code: WR-WTB; Height: 11.5mm; Pin Count: 2; Pitch: 2.54mm; Category: Wire-to-Board Connectors; Orientation: Vertical; Length: 5.08mm; ComponentLink1Description: Website Link; Manufacturer Part Number: 61900211121; Operating Temperature Max: 105°C; Component Type: Standard; Source: WR-WTB.SchLib; Width: 5.8mm; ComponentLink1URL: https://www.we-online.com/redexpert/article/61900211121?ad; Packaging: Bag; ComponentLink2URL: https://www.we-online.com/redexpert/spec/61900211121?ad; Number of Rows: 1; Pins: 2; Design Item ID: 61900211121; Operating Temperature Min: -40°C; Gender: Male; ComponentLink2Description: Datasheet Link; Mount: Through Hole
P17 = CMP-002-00010-2: WR-MPC3 THT Male Vertical Header, pitch 3mm, 2p; Manufacturer: Wurth Elektronik; Insulation Resistance: >1000MOhm; Rated Current: 5A; Contact Resistance: 10mOhm; Working Voltage: 250V (AC); Height: 11mm; Packaging: Tube; Component Type: Standard; Operating Temperature Max: 105°C; Manufacturer Part Number: 66200211122; Design Item ID: 66200211122; Number of Rows: 1; Mount: Through Hole; Source: WR-MPC3.SchLib; Category: Wire-to-Board Connectors; Pitch: 3mm; ComponentLink1URL: https://www.we-online.com/redexpert/article/66200211122?ad; Pin Count: 2; Match Code: WR-MPC3; Width: 5.57mm; Operating Temperature Min: -40°C; ComponentLink1Description: Website Link; Orientation: Vertical; Gender: Male; ComponentLink2URL: https://www.we-online.com/redexpert/spec/66200211122?ad; Length: 9.65mm; Pins: 2; ComponentLink2Description: Datasheet Link
R9-R29 R32 = CMP-009-00337-1: as R6 on sheet MCU; Mount: Surface Mount; Rated Power: 100mW; Packaging: Tape and Reel; Case/Package: 0603; ComponentLink1URL: https://www.we-online.com/redexpert/article/560112116014?ad; Height: 0.45mm; Manufacturer Part Number: 560112116014; ComponentLink1Description: Website Link; ComponentLink2URL: https://www.we-online.com/redexpert/spec/560112116014?ad; Source: WRIS-RSKS.SchLib; Operating Temperature Min: -55°C; Width: 0.8mm; Match Code: WRIS-RSKS; Design Item ID: 560112116014; ComponentLink2Description: Datasheet Link; Category: Thick Film Resistors; Operating Temperature Max: 155°C; Component Type: Standard; Length: 1.6mm; Pins: 2
R30 R31 R35-R38 = CMP-009-00328-1: as R1 on sheet MCU; ComponentLink1Description: Website Link; Case/Package: 0603; Pins: 2; Match Code: WRIS-RSKS; Operating Temperature Max: 155°C; Width: 0.8mm; Design Item ID: 560112116005; Length: 1.6mm; ComponentLink2Description: Datasheet Link; ComponentLink2URL: https://www.we-online.com/redexpert/spec/560112116005?ad; Packaging: Tape and Reel; Source: WRIS-RSKS.SchLib; Height: 0.45mm; Manufacturer Part Number: 560112116005; Component Type: Standard; Mount: Surface Mount; Operating Temperature Min: -55°C; Rated Power: 100mW; ComponentLink1URL: https://www.we-online.com/redexpert/article/560112116005?ad; Category: Thick Film Resistors
R33 R39 R40 = CMP-009-00343-1: WRIS-RSKS Thick Film Resistor, size 0603, 330Ohm, 100mW; Manufacturer: Wurth Elektronik; Temperature Coefficient of Resistance Max: 100ppm/°C; Limiting Element Voltage: 75V; Resistance Tolerance: +/-1%; Temperature Coefficient of Resistance Min: -100ppm/°C; Component Type: Standard; ComponentLink1URL: https://www.we-online.com/redexpert/article/560112116020?ad; Rated Power: 100mW; Mount: Surface Mount; Category: Thick Film Resistors; Design Item ID: 560112116020; Manufacturer Part Number: 560112116020; Width: 0.8mm; Match Code: WRIS-RSKS; Source: WRIS-RSKS.SchLib; Packaging: Tape and Reel; Length: 1.6mm; ComponentLink2URL: https://www.we-online.com/redexpert/spec/560112116020?ad; Height: 0.45mm; Case/Package: 0603; ComponentLink1Description: Website Link; Operating Temperature Max: 155°C; Operating Temperature Min: -55°C; ComponentLink2Description: Datasheet Link; Pins: 2
R34 = CMP-009-00364-1: WRIS-RSKS Thick Film Resistor, size 0603, 150Ohm, 100mW; Manufacturer: Wurth Elektronik; Resistance Tolerance: +/-1%; Temperature Coefficient of Resistance Min: -100ppm/°C; Temperature Coefficient of Resistance Max: 100ppm/°C; Limiting Element Voltage: 75V; ComponentLink1URL: https://www.we-online.com/redexpert/article/560112116041?ad; Width: 0.8mm; Mount: Surface Mount; Length: 1.6mm; ComponentLink2Description: Datasheet Link; Operating Temperature Min: -55°C; Packaging: Tape and Reel; Case/Package: 0603; Source: WRIS-RSKS.SchLib; ComponentLink2URL: https://www.we-online.com/redexpert/spec/560112116041?ad; Component Type: Standard; Manufacturer Part Number: 560112116041; Design Item ID: 560112116041; Rated Power: 100mW; Pins: 2; ComponentLink1Description: Website Link; Operating Temperature Max: 155°C; Height: 0.45mm; Category: Thick Film Resistors; Match Code: WRIS-RSKS

## Sheet Connectors_General.SchDoc
size A4; SheetNumber: 3; SheetTotal: 6
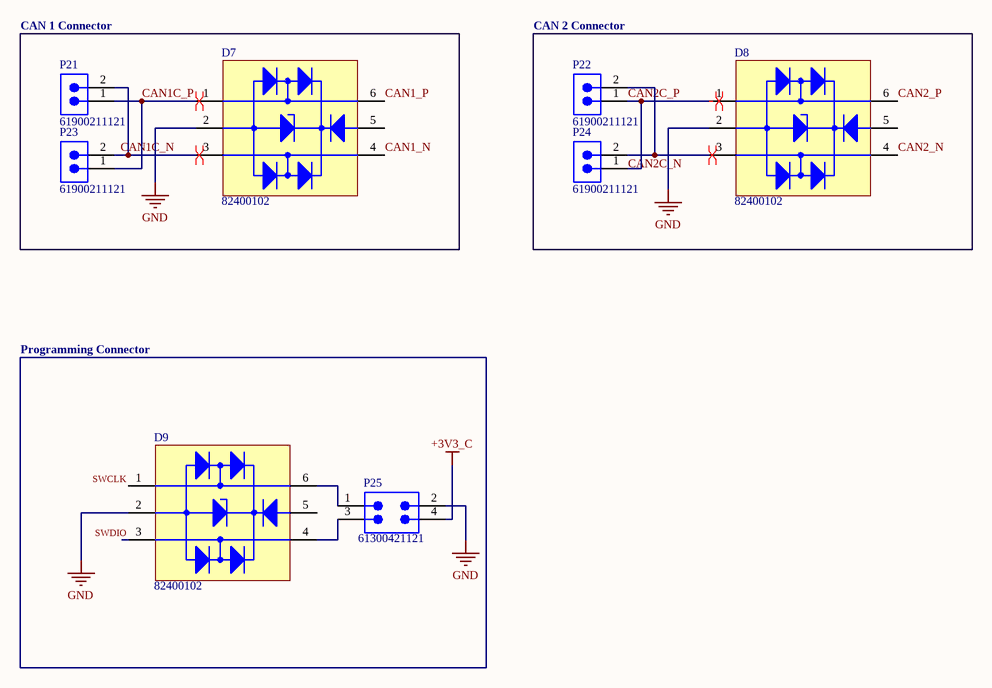
[diagram p2: Connectors_General.SchDoc]

### Parts
D7  82400102  [WE-TVS_SOT23-6L]
D8  82400102  [WE-TVS_SOT23-6L]
D9  82400102  [WE-TVS_SOT23-6L]
P21  61900211121  [61900211121]
P22  61900211121  [61900211121]
P23  61900211121  [61900211121]
P24  61900211121  [61900211121]
P25  61300421121  [61300421121]

### Blocks framed on the sheet
CAN 1 Connector: D7 P21 P23
CAN 2 Connector: D8 P22 P24
Programming Connector: D9 P25

### Nets
+3V3_C: P25.4
GND: D7.2(GND) D8.2(GND) D9.2(GND) P25.2
CAN1_N: D7.4(I/O_2)
CAN1_P: D7.6(I/O_1)
CAN1C_N: D7.3(I/O_2) P21.2 P23.2
CAN1C_P: D7.1(I/O_1) P21.1 P23.1
CAN2_N: D8.4(I/O_2)
CAN2_P: D8.6(I/O_1)
CAN2C_N: D8.3(I/O_2) P22.2 P24.2
CAN2C_P: D8.1(I/O_1) P22.1 P24.1
SWCLK: D9.1(I/O_1)
SWDIO: D9.3(I/O_2)
NetD9_4: D9.4(I/O_2) P25.3
NetD9_6: D9.6(I/O_1) P25.1

Not connected (* = marked no-connect by the designer): D7 5(VDD); D8 5(VDD); D9 5(VDD)

### Layout directives
differential pair: CAN1C_N, CAN1C_P, CAN2C_N, CAN2C_P

### Library data of the parts
D7-D9 = CMP-004-00017-1: WE-TVS TVS Diode – High Speed Series, SOT23-6L, 2+1 Channel, 5V, 2pF; Manufacturer: Wurth Elektronik; Polarity: Unidirectional; Channel ESD Clamping Voltage: 10V; ESD Air Discharge Capability: 15kV; (Reverse) Peak Pulse Current: 7A; (Reverse) Breakdown Voltage: 6V; Channel Reverse Leakage Current: 1uA; ESD Contact Discharge Capability: 8kV; Source: WE-TVS.SchLib; Component Type: Standard; Packaging: Tape and Reel; Height: 1.45mm; Pins: 6; Match Code: WE-TVS; Case/Package: SOT23-6L; Mount: Surface Mount; Channel Operating Voltage: 5V; ComponentLink1Description: Website Link; ComponentLink2URL: https://www.we-online.com/redexpert/spec/82400102?ad; Category: ESD Protection; Channel Input Capacitance: 2pF; Operating Temperature Min: -40°C; ComponentLink1URL: https://www.we-online.com/redexpert/article/82400102?ad; Length: 2.9mm; Width: 2.8mm; Manufacturer Part Number: 82400102; Design Item ID: 82400102; ComponentLink2Description: Datasheet Link; Operating Temperature Max: 125°C; Number of Channels: 2+1
P21-P24 = CMP-002-00287-1: as P16 on sheet Connectors_ADC; Match Code: WR-WTB; Height: 11.5mm; Pin Count: 2; Pitch: 2.54mm; Category: Wire-to-Board Connectors; Orientation: Vertical; Length: 5.08mm; ComponentLink1Description: Website Link; Manufacturer Part Number: 61900211121; Operating Temperature Max: 105°C; Component Type: Standard; Source: WR-WTB.SchLib; Width: 5.8mm; ComponentLink1URL: https://www.we-online.com/redexpert/article/61900211121?ad; Packaging: Bag; ComponentLink2URL: https://www.we-online.com/redexpert/spec/61900211121?ad; Number of Rows: 1; Pins: 2; Design Item ID: 61900211121; Operating Temperature Min: -40°C; Gender: Male; ComponentLink2Description: Datasheet Link; Mount: Through Hole
P25 = CMP-002-00747-2: Board Connector, 4 Contact(s), 2 Row(s), Male, Straight, 0.1 inch Pitch, Solder Terminal, Black Insulator, Plug; RoHS Compliant: Yes; Min Operating Temperature: -40°C; Mounting Technology: Board; Connector Type: BOARD CONNECTOR; Max Operating Temperature: 125°C

## Sheet Sensors.SchDoc
size A4; SheetNumber: 4; SheetTotal: 6; SPICEModelCacheKLIENLUT: <root> / <DocumentId>KLIENLUT</DocumentId> / <CacheFrame Number="0"> / <Model Name="0603_885012206071_100nf" Kind="CKT"> / <Text>******* / .subckt 0603_885012206071_100nF 1 2 / Rser 1 3 0.025 / Lser 2 4 0.0000000008 / C1 3 4 0.0000001 / Rpar 3 4 5000000000 / .ends 0603_885012206071_100nF</Text> / </Model> / <Model Name="0603_885012106012_4.7uf" Kind="CKT"> / <Text>******* / .subckt 0603_885012106012_4.7uF 1 2 / Rser 1 3 0.00455496693599 / Lser 2 4 5.03384516E-10 / C1 3 4 0.0000047 / Rpar 3 4 20000000 / .ends 0603_885012106012_4.7uF</Text> / </Model> / <Model Name="0603_885012206020_100nf" Kind="CKT"> / <Text>******* / .subckt 0603_885012206020_100nF 1 2 / Rser 1 3 0.0188883213835 / Lser 2 4 4.53593763E-10 / C1 3 4 0.0000001 / Rpar 3 4 5000000000 / .ends 0603_885012206020_100nF</Text> / </Model> / </CacheFrame> / </root>
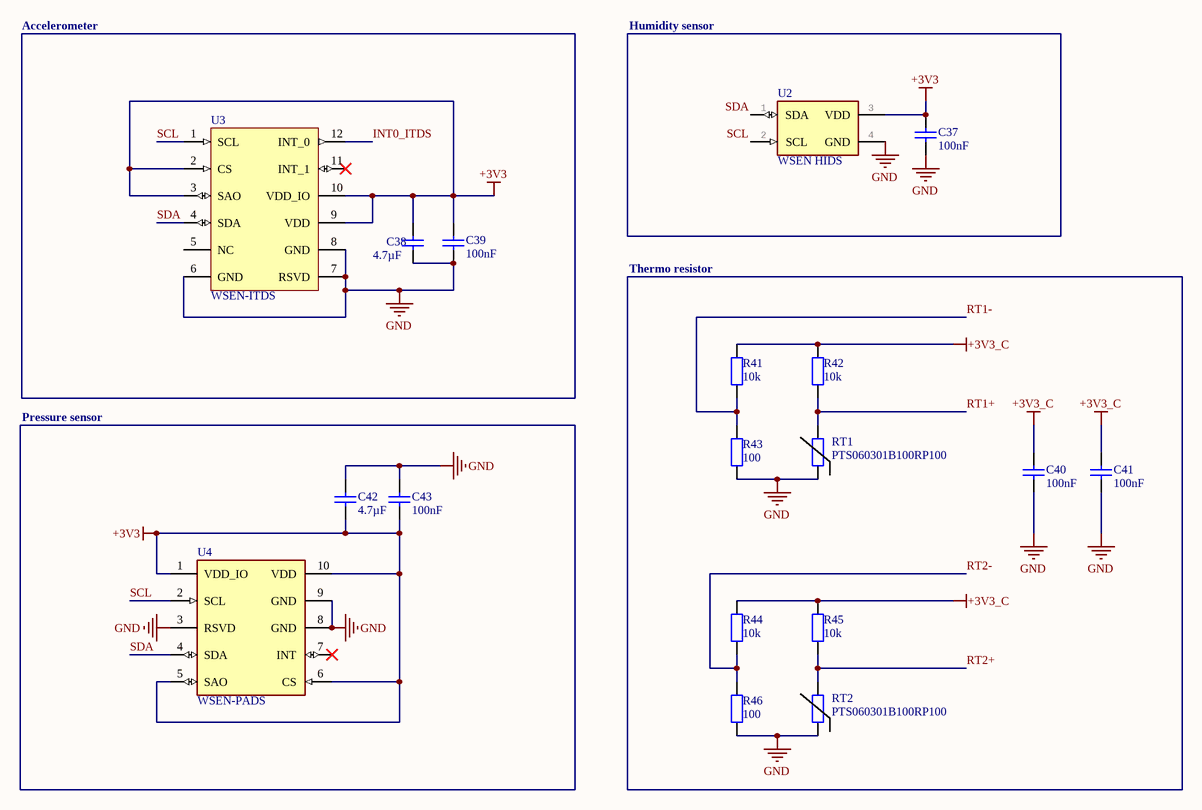
[diagram p3: Sensors.SchDoc]

### Parts
C37  value 100nF  [WCAP-CSGP_0603_L1.6W0.8H0.8_Reflow]  (hidden comment: 885012206071)
C38  value 4.7µF  [WCAP-CSGP_0603_L1.6W0.8H0.8_Reflow]  (hidden comment: 885012106012)
C39  value 100nF  [WCAP-CSGP_0603_L1.6W0.8H0.8_Reflow]  (hidden comment: 885012206071)
C40  value 100nF  [WCAP-CSGP_0603_L1.6W0.8H0.8_Reflow]  (hidden comment: 885012206020)
C41  value 100nF  [WCAP-CSGP_0603_L1.6W0.8H0.8_Reflow]  (hidden comment: 885012206020)
C42  value 4.7µF  [WCAP-CSGP_0603_L1.6W0.8H0.8_Reflow]  (hidden comment: 885012106012)
C43  value 100nF  [WCAP-CSGP_0603_L1.6W0.8H0.8_Reflow]  (hidden comment: 885012206071)
R41  value 10k  [WRIS-RSKS_0603_Reflow]  (hidden comment: 560112116005)
R42  value 10k  [WRIS-RSKS_0603_Reflow]  (hidden comment: 560112116005)
R43  value 100  [WRIS-RSKS_0603_Reflow]  (hidden comment: 560112116009)
R44  value 10k  [WRIS-RSKS_0603_Reflow]  (hidden comment: 560112116005)
R45  value 10k  [WRIS-RSKS_0603_Reflow]  (hidden comment: 560112116005)
R46  value 100  [WRIS-RSKS_0603_Reflow]  (hidden comment: 560112116009)
RT1  PTS060301B100RP100  [PTS060301B100RP100-Footprint-1]
RT2  PTS060301B100RP100  [PTS060301B100RP100-Footprint-1]
U2  WSEN HIDS  [WSEN HIDS-Footprint-1]
U3  WSEN-ITDS  [WSEN-ITDS-Footprint-1]
U4  WSEN-PADS  [WSEN-PADS-Footprint-1]

### Blocks framed on the sheet
Accelerometer: C38 C39 U3
Humidity sensor: C37 U2
Thermo resistor: C40 C41 R41-R46 RT1 RT2
Pressure sensor: C42 C43 U4

### Nets
+3V3: C37.2 C38.1 C39.2 C42.2 C43.1 U2.3(VDD) U3.2(CS) U3.3(SAO) U3.9(VDD) U3.10(VDD_IO) U4.1(VDD_IO) U4.5(SAO) U4.6(CS) U4.10(VDD)  [project net 3V3_Current-]
+3V3_C: C40.2 C41.2 R41.2 R42.2 R44.2 R45.2
GND: C37.1 C38.2 C39.1 C40.1 C41.1 C42.1 C43.2 R43.1 R46.1 RT1.1 RT2.1 U2.4(GND) U3.6(GND) U3.7(RSVD) U3.8(GND) U4.3(RSVD) U4.8(GND) U4.9(GND)
INT0_ITDS: U3.12(INT_0)
RT1+: R42.1 RT1.2
RT1-: R41.1 R43.2
RT2+: R45.1 RT2.2
RT2-: R44.1 R46.2
SCL: U2.2(SCL) U3.1(SCL) U4.2(SCL)
SDA: U2.1(SDA) U3.4(SDA) U4.4(SDA)

Not connected (* = marked no-connect by the designer): U3 5(NC) 11(INT_1)*; U4 7(INT)*

### Library data of the parts
C37 C39 C43 = CMP-001-00661-1: as C6 on sheet MCU; Packaging: Tape and Reel; Height: 0.8mm; Mount: Surface Mount; Source: WCAP-CSGP.SchLib; Component Type: Standard; Category: Multilayer Ceramic Chip Capacitors; Operating Temperature Min: -55°C; Case/Package: 0603; ComponentLink2Description: Datasheet Link; Width: 0.8mm; ComponentLink1URL: https://www.we-online.com/redexpert/article/885012206071?ad; Length: 1.6mm; Operating Temperature Max: 125°C; Match Code: WCAP-CSGP; ComponentLink2URL: https://www.we-online.com/redexpert/spec/885012206071?ad; Design Item ID: 885012206071; ComponentLink1Description: Website Link; Manufacturer Part Number: 885012206071; Pins: 2; Ceramic Type: X7R
C38 C42 = CMP-001-00440-1: as C7 on sheet MCU; ComponentLink2URL: https://www.we-online.com/redexpert/spec/885012106012?ad; Height: 0.8mm; Packaging: Tape and Reel; Case/Package: 0603; Manufacturer Part Number: 885012106012; Component Type: Standard; Width: 0.8mm; Match Code: WCAP-CSGP; Mount: Surface Mount; Ceramic Type: X5R; Operating Temperature Max: 85°C; ComponentLink1Description: Website Link; Length: 1.6mm; ComponentLink1URL: https://www.we-online.com/redexpert/article/885012106012?ad; ComponentLink2Description: Datasheet Link; Category: Multilayer Ceramic Chip Capacitors; Source: WCAP-CSGP.SchLib; Operating Temperature Min: -55°C; Pins: 2; Design Item ID: 885012106012
C40 C41 = CMP-001-00610-1: WCAP-CSGP Multilayer Ceramic Chip Capacitor, General Purpose, size 0603, X7R, 100nF, 10VDC; Manufacturer: Wurth Elektronik; Capacitance Tolerance: +/-10%; Technical Reference: X7R0603104K010DFCT10000; Insulation Resistance: 5GOhm; Rated Voltage (DC): 10V; Dissipation Factor: 5%; Operating Temperature Min: -55°C; Source: WCAP-CSGP.SchLib; Width: 0.8mm; Pins: 2; Category: Multilayer Ceramic Chip Capacitors; Manufacturer Part Number: 885012206020; Case/Package: 0603; ComponentLink1URL: https://www.we-online.com/redexpert/article/885012206020?ad; Length: 1.6mm; Height: 0.8mm; Component Type: Standard; Match Code: WCAP-CSGP; Design Item ID: 885012206020; ComponentLink2URL: https://www.we-online.com/redexpert/spec/885012206020?ad; Mount: Surface Mount; Packaging: Tape and Reel; Operating Temperature Max: 125°C; Ceramic Type: X7R; ComponentLink2Description: Datasheet Link; ComponentLink1Description: Website Link
R41 R42 R44 R45 = CMP-009-00328-1: as R1 on sheet MCU; ComponentLink1Description: Website Link; Case/Package: 0603; Pins: 2; Match Code: WRIS-RSKS; Operating Temperature Max: 155°C; Width: 0.8mm; Design Item ID: 560112116005; Length: 1.6mm; ComponentLink2Description: Datasheet Link; ComponentLink2URL: https://www.we-online.com/redexpert/spec/560112116005?ad; Packaging: Tape and Reel; Source: WRIS-RSKS.SchLib; Height: 0.45mm; Manufacturer Part Number: 560112116005; Component Type: Standard; Mount: Surface Mount; Operating Temperature Min: -55°C; Rated Power: 100mW; ComponentLink1URL: https://www.we-online.com/redexpert/article/560112116005?ad; Category: Thick Film Resistors
R43 R46 = CMP-009-00332-1: as R7 on sheet MCU; Mount: Surface Mount; Design Item ID: 560112116009; Height: 0.45mm; Category: Thick Film Resistors; Operating Temperature Min: -55°C; Width: 0.8mm; Manufacturer Part Number: 560112116009; ComponentLink2Description: Datasheet Link; Pins: 2; ComponentLink2URL: https://www.we-online.com/redexpert/spec/560112116009?ad; Component Type: Standard; Case/Package: 0603; ComponentLink1URL: https://www.we-online.com/redexpert/article/560112116009?ad; Rated Power: 100mW; ComponentLink1Description: Website Link; Operating Temperature Max: 155°C; Source: WRIS-RSKS.SchLib; Packaging: Tape and Reel; Length: 1.6mm; Match Code: WRIS-RSKS
RT1 RT2 = CMP-010-00008-1: RTD Platinum Sensor, 100ohm, Rectangular, Surface Mount; Sensor Type: TEMPERATURE SENSOR,RTD,PLATINUM; RoHS Compliant: Yes; Mounting Technology: Surface Mount; Min Operating Temperature: -55°C; Max Operating Temperature: 155°C; Case/Package: 0603
U2 = CMP-011-00001-1: Wsen-hids/ Humidity, temperature Sensor
U3 = CMP-010-00006-1: IMU (3 axis)
U4 = CMP-010-00002-1: Piezoresistive Sensor, Absolute pressure sensor; RoHS Compliant: Yes